# Altium schematic sheet MCU_STM32_SCHE.SchDoc
size A3
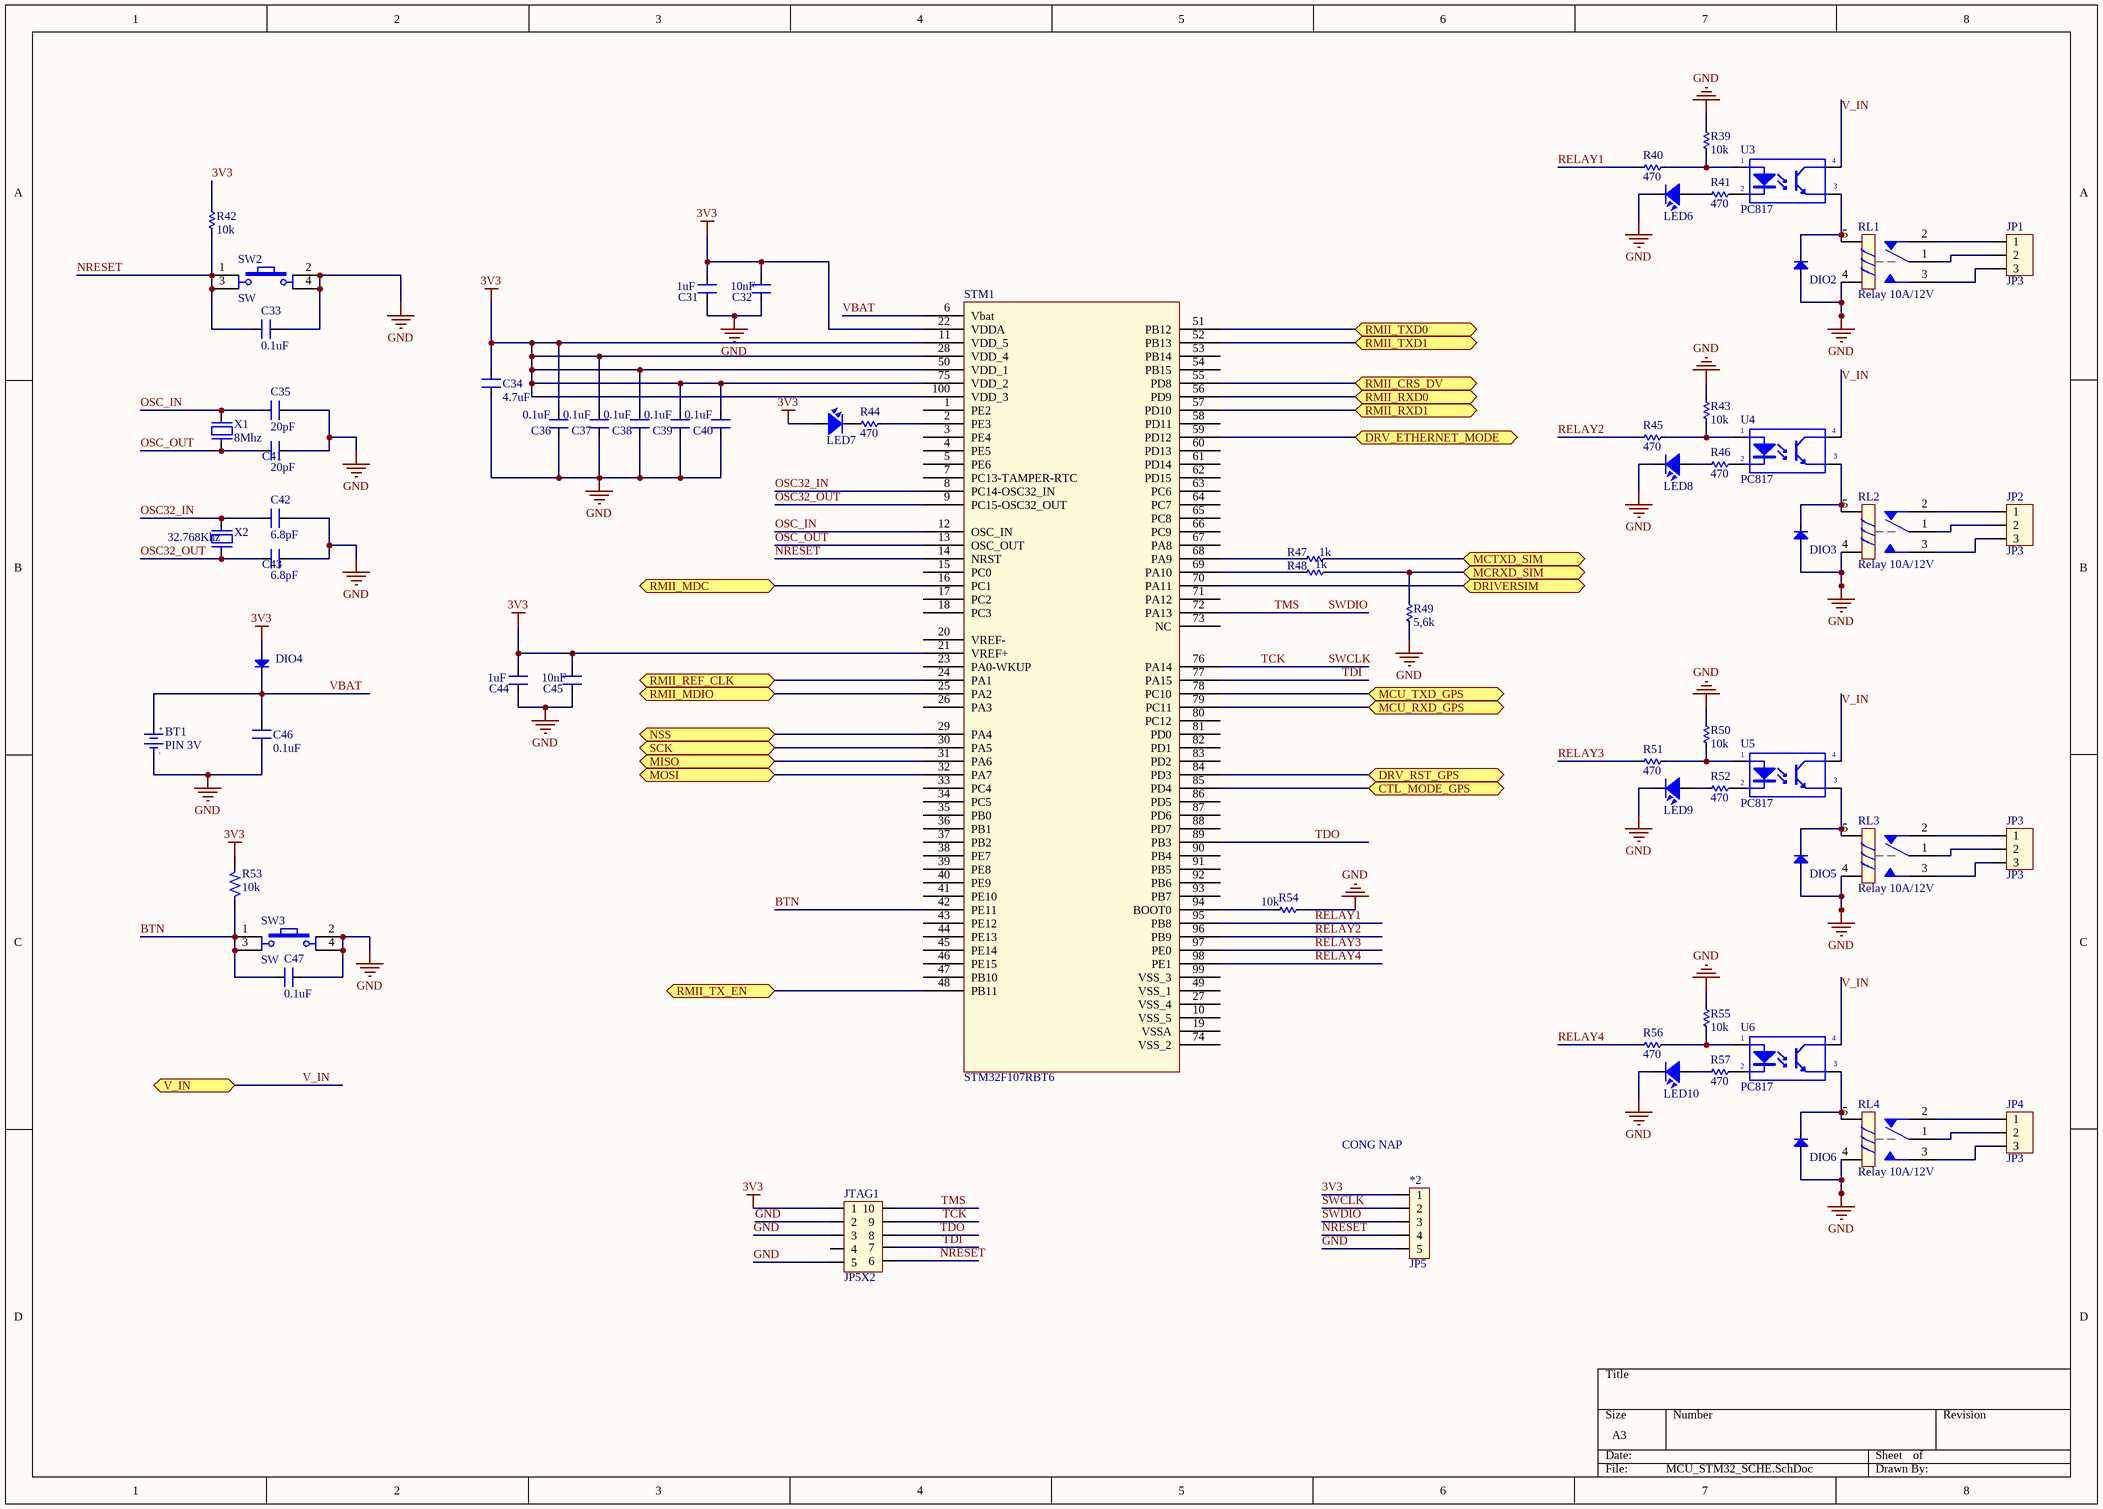
[diagram p0: MCU_STM32_SCHE.SchDoc]

## Parts
*2  JP5  [JP5]
BT1  PIN 3V  [PIN3V]
C31  1uF  [res 0805 - duplicate]
C32  10nF  [res 0805 - duplicate]
C33  0.1uF  [res 0805 - duplicate]
C34  4.7uF  [res 0805 - duplicate]
C35  20pF  [res 0805 - duplicate]
C36  0.1uF  [res 0805 - duplicate]
C37  0.1uF  [res 0805 - duplicate]
C38  0.1uF  [res 0805 - duplicate]
C39  0.1uF  [res 0805 - duplicate]
C40  0.1uF  [res 0805 - duplicate]
C41  20pF  [res 0805 - duplicate]
C42  6.8pF  [res 0805 - duplicate]
C43  6.8pF  [res 0805 - duplicate]
C44  1uF  [res 0805 - duplicate]
C45  10nF  [res 0805 - duplicate]
C46  0.1uF  [res 0805 - duplicate]
C47  0.1uF  [res 0805 - duplicate]
DIO2  Diode SMD  [DIOT-SS24]  (value not drawn)
DIO3  Diode SMD  [DIOT-SS24]  (value not drawn)
DIO4  Diode SMD  [DIO-SMD-123]  (value not drawn)
DIO5  Diode SMD  [DIOT-SS24]  (value not drawn)
DIO6  Diode SMD  [DIOT-SS24]  (value not drawn)
JP1  JP3  [CON3]
JP2  JP3  [CON3]
JP3  JP3  [CON3]
JP4  JP3  [CON3]
JTAG1  JP5X2  [JP5X2]
LED6  LED  [res 0805 - duplicate]  (value not drawn)
LED7  LED  [res 0805 - duplicate]  (value not drawn)
LED8  LED  [res 0805 - duplicate]  (value not drawn)
LED9  LED  [res 0805 - duplicate]  (value not drawn)
LED10  LED  [res 0805 - duplicate]  (value not drawn)
R39  10k  [res 0805 - duplicate]
R40  470  [res 0805 - duplicate]
R41  470  [res 0805 - duplicate]
R42  10k  [res 0805 - duplicate]
R43  10k  [res 0805 - duplicate]
R44  470  [res 0805 - duplicate]
R45  470  [res 0805 - duplicate]
R46  470  [res 0805 - duplicate]
R47  1k  [res 0805 - duplicate]
R48  1k  [res 0805 - duplicate]
R49  5,6k  [res 0805 - duplicate]
R50  10k  [res 0805 - duplicate]
R51  470  [res 0805 - duplicate]
R52  470  [res 0805 - duplicate]
R53  10k  [res 0805 - duplicate]
R54  10k  [res 0805 - duplicate]
R55  10k  [res 0805 - duplicate]
R56  470  [res 0805 - duplicate]
R57  470  [res 0805 - duplicate]
RL1  Relay 10A/12V  [RL_SPDT_10A]
RL2  Relay 10A/12V  [RL_SPDT_10A]
RL3  Relay 10A/12V  [RL_SPDT_10A]
RL4  Relay 10A/12V  [RL_SPDT_10A]
STM1  STM32F107RBT6  [STM32F107RBT6-LQFP100]
SW2  SW  [button]
SW3  SW  [button]
U3  PC817  [DIP4/W0.3]
U4  PC817  [DIP4/W0.3]
U5  PC817  [DIP4/W0.3]
U6  PC817  [DIP4/W0.3]
X1  8Mhz  [XT2]
X2  32.768Khz  [XT2]

## Ports
CTL_MODE_GPS, DRIVERSIM, DRV_ETHERNET_MODE, DRV_RST_GPS, MCRXD_SIM, MCTXD_SIM, MCU_RXD_GPS, MCU_TXD_GPS, MISO, MOSI, NSS, RMII_CRS_DV, RMII_MDC, RMII_MDIO, RMII_REF_CLK, RMII_RXD0, RMII_RXD1, RMII_TX_EN, RMII_TXD0, RMII_TXD1, SCK, V_IN

## Nets
3V3: *2.1 C31.2 C32.2 C34.2 C36.2 C37.2 C38.2 C39.2 C40.2 C44.2 C45.2 DIO4.1(A) JTAG1.1 LED7.1 R42.1 R53.2 STM1.11(VDD_5) STM1.21(VREF+) STM1.22(VDDA) STM1.28(VDD_4) STM1.50(VDD_1) STM1.75(VDD_2) STM1.100(VDD_3)
GND: *2.5 BT1.2(GND) C31.1 C32.1 C33.2 C34.1 C35.2 C36.1 C37.1 C38.1 C39.1 C40.1 C41.2 C42.2 C43.2 C44.1 C45.1 C46.1 C47.2 DIO2.1(A) DIO3.1(A) DIO5.1(A) DIO6.1(A) JTAG1.2 JTAG1.3 JTAG1.5 LED6.2 LED8.2 LED9.2 LED10.2 R39.1 R43.1 R49.2 R50.1 R54.2 R55.1 RL1.4 RL2.4 RL3.4 RL4.4 SW2.2 SW2.4 SW3.2 SW3.4
BTN: C47.1 R53.1 STM1.42(PE11) SW3.1 SW3.3
CTL_MODE_GPS: STM1.85(PD4) ; port CTL_MODE_GPS
DRIVERSIM: STM1.70(PA11) ; port DRIVERSIM
DRV_ETHERNET_MODE: STM1.59(PD12) ; port DRV_ETHERNET_MODE
DRV_RST_GPS: STM1.84(PD3) ; port DRV_RST_GPS
MCRXD_SIM: R48.1 R49.1 ; port MCRXD_SIM
MCTXD_SIM: R47.1 ; port MCTXD_SIM
MCU_RXD_GPS: STM1.79(PC11) ; port MCU_RXD_GPS
MCU_TXD_GPS: STM1.78(PC10) ; port MCU_TXD_GPS
MISO: STM1.31(PA6) ; port MISO
MOSI: STM1.32(PA7) ; port MOSI
NRESET: *2.4 C33.1 JTAG1.6 R42.2 STM1.14(NRST) SW2.1 SW2.3
NSS: STM1.29(PA4) ; port NSS
OSC32_IN: C42.1 STM1.8(PC14-OSC32_IN) X2.2
OSC32_OUT: C43.1 STM1.9(PC15-OSC32_OUT) X2.1
OSC_IN: C35.1 STM1.12(OSC_IN) X1.2
OSC_OUT: C41.1 STM1.13(OSC_OUT) X1.1
RELAY1: R40.2 STM1.95(PB8)
RELAY2: R45.2 STM1.96(PB9)
RELAY3: R51.2 STM1.97(PE0)
RELAY4: R56.2 STM1.98(PE1)
RMII_CRS_DV: STM1.55(PD8) ; port RMII_CRS_DV
RMII_MDC: STM1.16(PC1) ; port RMII_MDC
RMII_MDIO: STM1.25(PA2) ; port RMII_MDIO
RMII_REF_CLK: STM1.24(PA1) ; port RMII_REF_CLK
RMII_RXD0: STM1.56(PD9) ; port RMII_RXD0
RMII_RXD1: STM1.57(PD10) ; port RMII_RXD1
RMII_TX_EN: STM1.48(PB11) ; port RMII_TX_EN
RMII_TXD0: STM1.51(PB12) ; port RMII_TXD0
RMII_TXD1: STM1.52(PB13) ; port RMII_TXD1
SCK: STM1.30(PA5) ; port SCK
SWCLK: *2.2 JTAG1.9 STM1.76(PA14)  [also labelled TCK]
SWDIO: *2.3 JTAG1.10 STM1.72(PA13)  [also labelled TMS]
TDI: JTAG1.7 STM1.77(PA15)
TDO: JTAG1.8 STM1.89(PB3)
V_IN: U3.4(C) U4.4(C) U5.4(C) U6.4(C) ; port V_IN
VBAT: BT1.1(+3V) C46.2 DIO4.2(K) STM1.6(Vbat)
NetDIO2_2: DIO2.2(K) RL1.5 U3.3(E)
NetDIO3_2: DIO3.2(K) RL2.5 U4.3(E)
NetDIO5_2: DIO5.2(K) RL3.5 U5.3(E)
NetDIO6_2: DIO6.2(K) RL4.5 U6.3(E)
NetJP1_1: JP1.1 RL1.2
NetJP1_2: JP1.2 RL1.1
NetJP1_3: JP1.3 RL1.3
NetJP2_1: JP2.1 RL2.2
NetJP2_2: JP2.2 RL2.1
NetJP2_3: JP2.3 RL2.3
NetJP3_1: JP3.1 RL3.2
NetJP3_2: JP3.2 RL3.1
NetJP3_3: JP3.3 RL3.3
NetJP4_1: JP4.1 RL4.2
NetJP4_2: JP4.2 RL4.1
NetJP4_3: JP4.3 RL4.3
NetLED6_1: LED6.1 R41.2
NetLED7_2: LED7.2 R44.2
NetLED8_1: LED8.1 R46.2
NetLED9_1: LED9.1 R52.2
NetLED10_1: LED10.1 R57.2
NetR39_2: R39.2 R40.1 U3.1(A)
NetR41_1: R41.1 U3.2(K)
NetR43_2: R43.2 R45.1 U4.1(A)
NetR44_1: R44.1 STM1.2(PE3)
NetR46_1: R46.1 U4.2(K)
NetR47_2: R47.2 STM1.68(PA9)
NetR48_2: R48.2 STM1.69(PA10)
NetR50_2: R50.2 R51.1 U5.1(A)
NetR52_1: R52.1 U5.2(K)
NetR54_1: R54.1 STM1.94(BOOT0)
NetR55_2: R55.2 R56.1 U6.1(A)
NetR57_1: R57.1 U6.2(K)

Not connected (* = marked no-connect by the designer): JTAG1 4; STM1 1(PE2) 3(PE4) 4(PE5) 5(PE6) 7(PC13-TAMPER-RTC) 10(VSS_5) 15(PC0) 17(PC2) 18(PC3) 19(VSSA) 20(VREF-) 23(PA0-WKUP) 26(PA3) 27(VSS_4) 33(PC4) 34(PC5) 35(PB0) 36(PB1) 37(PB2) 38(PE7) 39(PE8) 40(PE9) 41(PE10) 43(PE12) 44(PE13) 45(PE14) 46(PE15) 47(PB10) 49(VSS_1) 53(PB14) 54(PB15) 58(PD11) 60(PD13) 61(PD14) 62(PD15) 63(PC6) 64(PC7) 65(PC8) 66(PC9) 67(PA8) 71(PA12) 73(NC) 74(VSS_2) 80(PC12) 81(PD0) 82(PD1) 83(PD2) 86(PD5) 87(PD6) 88(PD7) 90(PB4) 91(PB5) 92(PB6) 93(PB7) 99(VSS_3)

## Notes on the sheet
- (near *2) CONG NAP
- (in symbol PIN 3V) +; -

## Library data of the parts
BT1 = PIN 3V: Battery 3VDC; Value: PIN 3V
C31-C33 C35-C47 = CM: Cap SMD; Value: 103
C34 = CN: Value: 0,1uF/300V; Designed by: VanDungEvn
DIO2-DIO6 = Diode SMD: Default Diode; Code - JEDEC: DO-214-AB; Value: 1N5007; Published: 8-Jun-2000; Revision: July-2002: Re-released for DXP Platform.; Publisher: Altium Limited
JP1-JP4 = Con3: Connector 3; Value: Connector 3
LED6-LED10 = LED SMD: Value: LED 3 - 5 ly 2 Colour
R39-R52 R54-R57 = Res-SMD: Resistor; Manufacturer: Generic Components; Class: Passive; Published: 08/06/2000; Publisher: Altium Hobart Technology Centre
R53 = R: Resistor 1/4W; Value: R1/4W - 1K
RL1-RL4 = Relay 1: Relay SPDT,10A - 12VDC 5 Pin; Value: Relay SPDT, 10A, 12V
SW2 SW3 = SW4: Switch button 4 pin; Value: Button chip 4 pin
  SW2: wed: https://www.digikey.com/product-detail/en/c-k/PTS645SK50SMTR92-LFS/CKN9087TR-ND/1162183
U3-U6 = PC817: Single Opto; Value: PC817
X1 X2 = XT2: Crystal, 32.768 KHz, -40 to 85 degC, 3.2 x 1.5 x 0.9 mm SMD; Value: 4Mhz